# Altium schematic sheet FPGA_MGT.SchDoc: SPEC-A7
size 420 x 297 mm; Author: G.Kasprowicz; CompanyName: WUT ISE; DrawnBy: G.Kasprowicz; Organization: WUT ISE; Address1: PW ISE; Address2: Nowowiejska 15/19 00-665 Warsaw; Address3: gkasprow@gmail.com; Revision: 2; SheetNumber: 5; SheetTotal: 18; ModifiedBy: -; CheckedDate: -; Title2: FPGA MGT; DivGrp: WUT ISE; Designer: G.Kasprowicz; ModifiedDate: -; ProjectName: Sensor Box
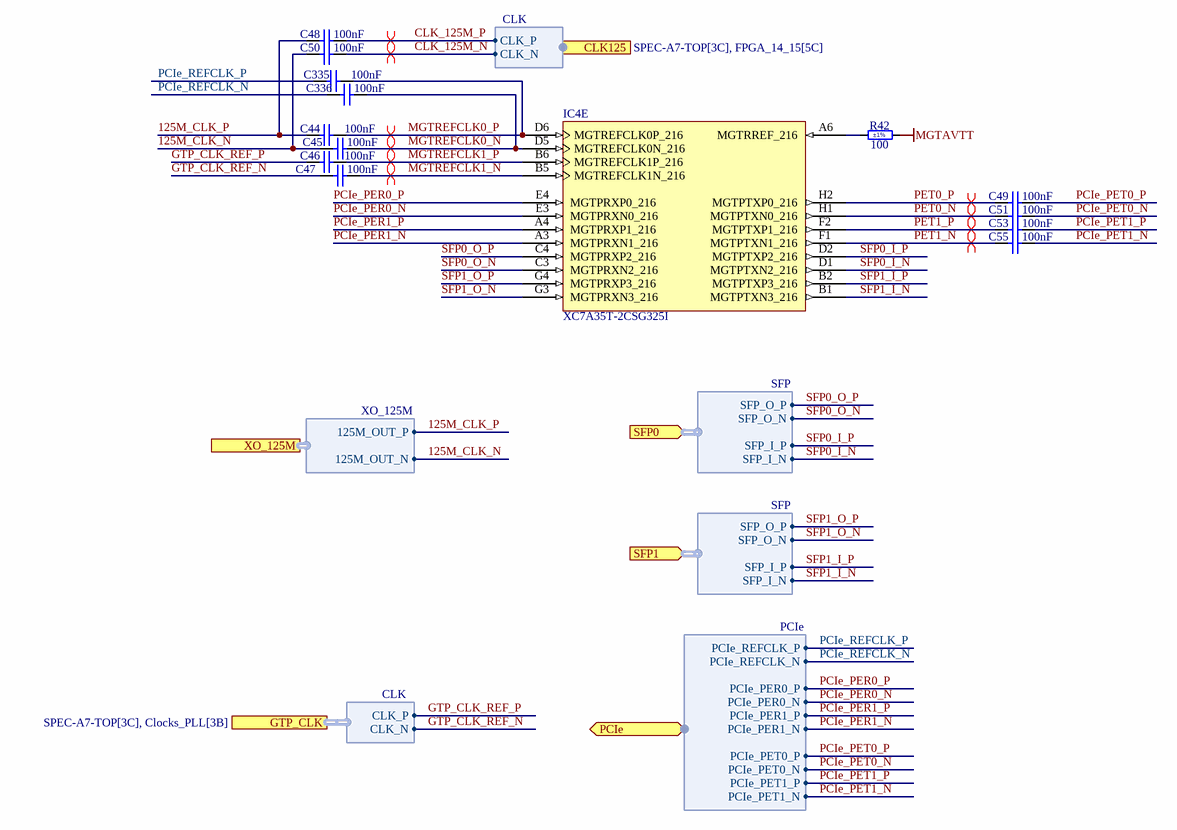
[diagram p0: FPGA_MGT.SchDoc]

## Parts
C44  100nF  [CAPC0603X33N]
C45  100nF  [CAPC0603X33N]
C46  100nF  [CAPC0603X33N]
C47  100nF  [CAPC0603X33N]
C48  100nF  [CAPC0603X33N]
C49  100nF  [CAPC0603X33N]
C50  100nF  [CAPC0603X33N]
C51  100nF  [CAPC0603X33N]
C53  100nF  [CAPC0603X33N]
C55  100nF  [CAPC0603X33N]
C335  100nF  [CAPC0603X33N]
C336  100nF  [CAPC0603X33N]
IC4  XC7A35T-2CSG325I  [CSG325]  (part E of 9)
R42  100  Tolerance: ±1%  [RESC1005X40N]

## Ports
CLK125 (harness CLK, see SPEC-A7-TOP[3C], FPGA_14_15[5C]), GTP_CLK (harness CLK, see SPEC-A7-TOP[3C], Clocks_PLL[3B]), PCIe (bidir, harness PCIe, see SPEC-A7-TOP[3C], PCIe[1D]), SFP0 (in, harness SFP, see SPEC-A7-TOP[3C], SFP[3A]), SFP1 (in, harness SFP, see SPEC-A7-TOP[3C], SFP[3C]), XO_125M (harness XO_125M, see SPEC-A7-TOP[3C], XO_125M[3C])

## Harnesses
XO_125M: 125M_OUT_P, 125M_OUT_N
SFP: SFP_O_P, SFP_O_N, SFP_I_P, SFP_I_N
PCIe: PCIe_REFCLK_P, PCIe_REFCLK_N, PCIe_PER0_P, PCIe_PER0_N, PCIe_PER1_P, PCIe_PER1_N, PCIe_PET0_P, PCIe_PET0_N, PCIe_PET1_P, PCIe_PET1_N
CLK: CLK_P, CLK_N

## Nets
MGTAVTT: R42.2
125M_CLK_N: C45.1 C50.1 ; port XO_125M.125M_OUT_N
125M_CLK_P: C44.1 C48.1 ; port XO_125M.125M_OUT_P
CLK_125M_N: C50.2 ; port CLK125.CLK_N
CLK_125M_P: C48.2 ; port CLK125.CLK_P
GTP_CLK_REF_N: C47.1 ; port GTP_CLK.CLK_N
GTP_CLK_REF_P: C46.1 ; port GTP_CLK.CLK_P
MGTREFCLK0_N: C45.2 C336.2 IC4.D5(MGTREFCLK0N_216)
MGTREFCLK0_P: C44.2 C335.2 IC4.D6(MGTREFCLK0P_216)
MGTREFCLK1_N: C47.2 IC4.B5(MGTREFCLK1N_216)
MGTREFCLK1_P: C46.2 IC4.B6(MGTREFCLK1P_216)
PCIe_PER0_N: IC4.E3(MGTPRXN0_216) ; port PCIe.PCIe_PER0_N
PCIe_PER0_P: IC4.E4(MGTPRXP0_216) ; port PCIe.PCIe_PER0_P
PCIe_PER1_N: IC4.A3(MGTPRXN1_216) ; port PCIe.PCIe_PER1_N
PCIe_PER1_P: IC4.A4(MGTPRXP1_216) ; port PCIe.PCIe_PER1_P
PCIe_PET0_N: C51.2 ; port PCIe.PCIe_PET0_N
PCIe_PET0_P: C49.2 ; port PCIe.PCIe_PET0_P
PCIe_PET1_N: C55.2 ; port PCIe.PCIe_PET1_N
PCIe_PET1_P: C53.2 ; port PCIe.PCIe_PET1_P
PCIe_REFCLK_N: C336.1 ; port PCIe.PCIe_REFCLK_N
PCIe_REFCLK_P: C335.1 ; port PCIe.PCIe_REFCLK_P
PET0_N: C51.1 IC4.H1(MGTPTXN0_216)
PET0_P: C49.1 IC4.H2(MGTPTXP0_216)
PET1_N: C55.1 IC4.F1(MGTPTXN1_216)
PET1_P: C53.1 IC4.F2(MGTPTXP1_216)
SFP0_I_N: IC4.D1(MGTPTXN2_216) ; port SFP0.SFP_I_N
SFP0_I_P: IC4.D2(MGTPTXP2_216) ; port SFP0.SFP_I_P
SFP0_O_N: IC4.C3(MGTPRXN2_216) ; port SFP0.SFP_O_N
SFP0_O_P: IC4.C4(MGTPRXP2_216) ; port SFP0.SFP_O_P
SFP1_I_N: IC4.B1(MGTPTXN3_216) ; port SFP1.SFP_I_N
SFP1_I_P: IC4.B2(MGTPTXP3_216) ; port SFP1.SFP_I_P
SFP1_O_N: IC4.G3(MGTPRXN3_216) ; port SFP1.SFP_O_N
SFP1_O_P: IC4.G4(MGTPRXP3_216) ; port SFP1.SFP_O_P
NetIC4_A6: IC4.A6(MGTRREF_216) R42.1

## Layout directives
differential pair: CLK_125M_N, CLK_125M_P, MGTREFCLK0_N, MGTREFCLK0_P, MGTREFCLK1_N, MGTREFCLK1_P, PET0_N, PET0_P, PET1_N, PET1_P

## Notes on the sheet
- Project/Equipment
- Document
- Designer
- Drawn by
- Check.by
- Copyright WUT ISE 2024.
  This documentation describes Open Hardware and is licensed under the CERN OHL v.2. You may redistribute and modify this documentation under the terms of the CERN OHL v.2. (http://ohwr.org/CERNOHL). This documentation is distributed WITHOUT ANY EXPRESS OR IMPLIED WARRANTY, INCLUDING OF MERCHANTABILITY, SATISFACTORY QUALITY AND FITNESS FOR A PARTICULAR PURPOSE. Please see the CERN OHL v.2 for applicable conditions.
- Contact
- File
- Last Mod.
- Print Date
- Sheet
- Size
- A3
- of
- Rev

## Library data of the parts
C44-C51 C53 C55 C335 C336 = CC0201_100NF_6.3V_10%_X5R: Non-polarised capacitor; Part Description: SMD Multilayer Chip Ceramic Capacitor; Manufacturer: GENERIC; Manufacturer1 Part Number: 02016D104KAT2A; Voltage: 6.3V; TC: X5R; Tolerance: ±10%; Part Number: CC0201_100NF_6.3V_10%_X5R; Component Kind: Standard; Component Type: Standard; Pin Count: 2; Value: 100nF; Status: Not Recommended; Manufacturer Part Number: CC0201_100NF_6.3V_10%_X5R; Case: 0201; Mounted: Yes; Socket: No; SMD: Yes; Sense: No; Manufacturer1 Example: AVX; Manufacturer1 ComponentHeight: 0.33mm; HelpURL: \\cern.ch\dfs\Applications\Altium\Datasheets\CC0201_X5R_AVX.pdf; Author: CERN DEM JLC; CreateDate: 03.12.2007; LatestRevisionDate: 03.12.2007
IC4 = CMP-0383-00003-1: Artix-7 FPGA, 150 User I/Os, 4 GTP, 324-Ball BGA, Speed Grade 2, Industrial Grade, Pb-Free; Manufacturer: Xilinx; Available User I/O: 150; Speed Grades: 2; GTP: 4; Logic Cells: 33280; Total Block RAM: 1800 Kb; CMTs: 5; ComponentLink3URL: http://www.xilinx.com/support/documentation/user_guides/ug475_7Series_Pkg_Pinout.pdf; Maximum Distributed RAM: 400 Kb; Operating Temperature Range: Industrial; ComponentLink1URL: http://www.xilinx.com/; Mounting Technology: Surface Mount; ComponentLink1Description: Manufacturer URL; ComponentLink2Description: Datasheet; PartNumber: XC7A35T-2CSG325I; PackageVersion: Rev. 1.11; PackageDescription: 324-Ball Wire-Bond Chip-Scale BGA, Body 15 x 15 mm, Pitch 0.8 mm; DatasheetVersion: Rev. 1.15; PackageReference: CSG-325; ComponentLink3Description: Pinout; ComponentLink4Description: Package Specification; ComponentLink2URL: http://www.xilinx.com/support/documentation/data_sheets/ds180_7Series_Overview.pdf; ComponentLink4URL: http://www.xilinx.com/support/documentation/user_guides/ug475_7Series_Pkg_Pinout.pdf
R42 = R0402_100R_1%_0.0625W_100PPM: Resistor - 1%; Part Description: General Purpose Thick Film Chip Resistor; Manufacturer: GENERIC; Manufacturer1 Part Number: 232270671001L; TC: ±100ppm/°C; PressFit: No; Part Number: R0402_100R_1%_0.0625W_100PPM; Component Kind: Standard; Component Type: Standard; Pin Count: 2; Value: 100; Status: Not Recommended; Power: 0.0625W; Manufacturer Part Number: R0402_100R_1%_0.0625W_100PPM; Case: 0402; Mounted: Yes; Sense: No; Socket: No; SMD: Yes; Manufacturer1 Example: YAGEO PHYCOMP; Manufacturer1 ComponentHeight: 0.4mm; HelpURL: \\cern.ch\dfs\Applications\Altium\Datasheets\R0402_Phycomp_RC0402.pdf; Author: CERN DEM JLC; CreateDate: 03.12.2007; LatestRevisionDate: 17.10.2012